# Altium schematic sheet SH6 - High Side Driver.SchDoc: HIGH SIDE DRIVER
size B; Engineer: Tibi Andronescu; Revision: 3; SheetNumber: 6; SheetTotal: 6
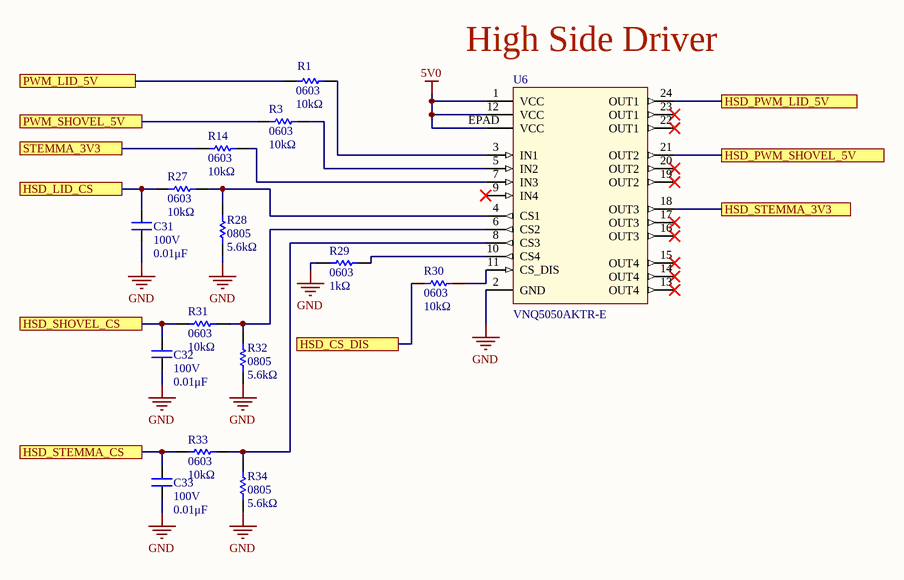
[diagram p0: SH6 - High Side Driver.SchDoc]

## Parts
C31  value 0.01μF  Voltage Rating: 100V  [CAP0603]  (hidden comment: CAP_0.01uF_100V_0603)
C32  value 0.01μF  Voltage Rating: 100V  [CAP0603]  (hidden comment: CAP_0.01uF_100V_0603)
C33  value 0.01μF  Voltage Rating: 100V  [CAP0603]  (hidden comment: CAP_0.01uF_100V_0603)
R1  value 10kΩ  Package/Footprint: 0603  [RESC0603]  (hidden comment: RES_10kΩ_0603_5%)
R3  value 10kΩ  Package/Footprint: 0603  [RESC0603]  (hidden comment: RES_10kΩ_0603_5%)
R14  value 10kΩ  Package/Footprint: 0603  [RESC0603]  (hidden comment: RES_10kΩ_0603_5%)
R27  value 10kΩ  Package/Footprint: 0603  [RESC0603]  (hidden comment: RES_10kΩ_0603_5%)
R28  value 5.6kΩ  Package: 0805  [RESC0805]  (hidden comment: RES_5.6kΩ_0805)
R29  value 1kΩ  Package/Footprint: 0603  [RESC0603]  (hidden comment: RES_1kΩ_0603_5%)
R30  value 10kΩ  Package/Footprint: 0603  [RESC0603]  (hidden comment: RES_10kΩ_0603_5%)
R31  value 10kΩ  Package/Footprint: 0603  [RESC0603]  (hidden comment: RES_10kΩ_0603_5%)
R32  value 5.6kΩ  Package: 0805  [RESC0805]  (hidden comment: RES_5.6kΩ_0805)
R33  value 10kΩ  Package/Footprint: 0603  [RESC0603]  (hidden comment: RES_10kΩ_0603_5%)
R34  value 5.6kΩ  Package: 0805  [RESC0805]  (hidden comment: RES_5.6kΩ_0805)
U6  VNQ5050AKTR-E  [PowerSSO-24_STM]

## Ports
HSD_CS_DIS, HSD_LID_CS, HSD_PWM_LID_5V, HSD_PWM_SHOVEL_5V, HSD_SHOVEL_CS, HSD_STEMMA_3V3, HSD_STEMMA_CS, PWM_LID_5V, PWM_SHOVEL_5V, STEMMA_3V3

## Nets
5V0: U6.1(VCC) U6.12(VCC) U6.EPAD(VCC)
GND: C31.1 C32.1 C33.1 R28.1 R29.1 R32.1 R34.1 U6.2(GND)
HSD_CS_DIS: R30.1 ; port HSD_CS_DIS
HSD_LID_CS: C31.2 R27.1 ; port HSD_LID_CS
HSD_PWM_LID_5V: U6.24(OUT1) ; port HSD_PWM_LID_5V
HSD_PWM_SHOVEL_5V: U6.21(OUT2) ; port HSD_PWM_SHOVEL_5V
HSD_SHOVEL_CS: C32.2 R31.1 ; port HSD_SHOVEL_CS
HSD_STEMMA_3V3: U6.18(OUT3) ; port HSD_STEMMA_3V3
HSD_STEMMA_CS: C33.2 R33.1 ; port HSD_STEMMA_CS
PWM_LID_5V: R1.1 ; port PWM_LID_5V
PWM_SHOVEL_5V: R3.1 ; port PWM_SHOVEL_5V
STEMMA_3V3: R14.1 ; port STEMMA_3V3
NetR1_2: R1.2 U6.3(IN1)
NetR3_2: R3.2 U6.5(IN2)
NetR14_2: R14.2 U6.7(IN3)
NetR27_2: R27.2 R28.2 U6.4(CS1)
NetR29_2: R29.2 U6.10(CS4)
NetR30_2: R30.2 U6.11(CS_DIS)
NetR31_2: R31.2 R32.2 U6.6(CS2)
NetR33_2: R33.2 R34.2 U6.8(CS3)

Not connected (* = marked no-connect by the designer): U6 9(IN4)* 13(OUT4)* 14(OUT4)* 15(OUT4)* 16(OUT3)* 17(OUT3)* 19(OUT2)* 20(OUT2)* 22(OUT1)* 23(OUT1)*

## Notes on the sheet
- (near U6) High Side Driver
- Title:
- Project:
- Date:
- Rev:
- Reviewer:
- Engineer:
- Sheet:
- of

## Library data of the parts
C31-C33 = CAP_0.01uF_100V_0603: CAP CER 10000PF 100V X7R 0603; Manufacturer Part Number 1: GCM188R72A103KA37J; Manufacturer 1: Murata Electronics; Supplier Part Number 1: 490-8028-1-ND; Supplier 1: Digi-Key; Dielectric: X7R
R1 R3 R14 R27 R30 R31 R33 = RES_10kΩ_0603_5%: RES 10K OHM 5% 1/10W 0603; Manufacturer 1: Yageo; Manufacturer Part Number 1: RC0603JR-0710KL; Supplier Part Number 1: 311-10KGRCT-ND; Supplier 1: Digi-Key; Mounting Type: SMD
R28 R32 R34 = RES_5.6kΩ_0805_5%: RES SMD 5.6K OHM 5% 1/8W 0805; Manufacturer 1: Yageo; Manufacturer Part Number 1: RC0805JR-075K6L; Supplier 1: Digi-Key; Supplier Part Number 1: 311-5.6KARCT-ND; Tolerance: 5%
R29 = RES_1kΩ_0603_5%: RES 1K OHM 5% 1/10W 0603; Manufacturer 1: Yageo; Manufacturer Part Number 1: RC0603JR-071KL; Supplier Part Number 1: 311-1.0KGRCT-ND; Supplier 1: Digi-Key; Mounting Type: SMD
U6 = VNQ5050AKTR-E: High Side Driver 24-Pin PowerSSO EP T/R; Manufacturer 1: STMicroelectronics; Max Supply Voltage: 36V; Operating Supply Voltage: 13V; Min Supply Voltage: 4.5V; Nominal Supply Current: 14mA; Number of Outputs: 4; Interface: On/Off; Max Output Current: 13.5A; Turn-Off Delay Time: 45us; Turn-On Delay Time: 20us; Fault Protection: Over Voltage,Over Temperature; Rds On: 50mOhm; Supplier 1: Digi-Key; Category: Hot Swap Controllers; Pricing 1: 1=5.08000, 10=4.55900, 25=4.30960, 100=3.54350, 250=3.17960, 500=3.16224 (USD); Mounting Type: SM; Number of Pins: 24; Min Operating Temperature: -40°C; Max Operating Temperature: 150°C; Packaging: Tape and Reel; Package Quantity: 1000; Number of Drivers: 4; Output Configuration: High Side; Series: VIPower™; Supply Current: 14mA; Radiation Hardening: No; Lead Free: Lead Free; RoHS Compliant: Yes; ComponentLink1URL: https://datasheet.ciiva.com/1955/cd00154145-1955496.pdf?src-supplier=Digi-Key; ComponentLink1Description: https://datasheet.ciiva.com/1955/cd00154145-1955496.pdf?src-supplier=Digi-Key; ComponentLink2URL: https://datasheet.ciiva.com/1955/cd00154145-1955494.pdf?src-supplier=Digi-Key; ComponentLink2Description: https://datasheet.ciiva.com/1955/cd00154145-1955494.pdf?src-supplier=Digi-Key; ComponentLink3URL: https://datasheet.ciiva.com/1955/cd00154145-1955495.pdf?src-supplier=Digi-Key; ComponentLink3Description: https://datasheet.ciiva.com/1955/cd00154145-1955495.pdf?src-supplier=Digi-Key; ComponentLink4URL: https://datasheet.ciiva.com/17564/cd00154145-17564423.pdf?src-supplier=Avnet+Europe; ComponentLink4Description: https://datasheet.ciiva.com/17564/cd00154145-17564423.pdf?src-supplier=Avnet+Europe; Supplier Part Number 1: 497-11477-1-ND; Verified: No; Manufacturer Part Number 1: VNQ5050AKTR-E